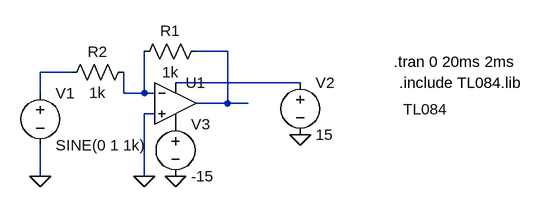
[diagram p0: schematic 03-Invert.asc]
03-Invert.asc, the LTspice schematic file:
Version 4
SHEET 1 880 680
WIRE 256 96 208 96
WIRE 16 128 -32 128
WIRE 368 144 176 144
WIRE -32 160 -32 128
WIRE 96 160 96 128
WIRE 128 160 128 96
WIRE 128 160 96 160
WIRE 144 160 128 160
WIRE 256 176 256 96
WIRE 256 176 208 176
WIRE 288 176 256 176
WIRE 144 192 128 192
WIRE -32 288 -32 240
WIRE 128 288 128 192
FLAG -32 288 0
FLAG 128 288 0
FLAG 368 224 0
FLAG 176 288 0
SYMBOL res 224 80 R90
WINDOW 0 0 56 VBottom 2
WINDOW 3 32 56 VTop 2
SYMATTR InstName R1
SYMATTR Value 1k
SYMBOL res 112 112 R90
WINDOW 0 0 56 VBottom 2
WINDOW 3 32 56 VTop 2
SYMATTR InstName R2
SYMATTR Value 1k
SYMBOL voltage -32 144 R0
WINDOW 123 0 0 Left 0
WINDOW 39 0 0 Left 0
SYMATTR InstName V1
SYMATTR Value SINE(0 1 1k)
SYMBOL voltage 368 128 R0
WINDOW 123 0 0 Left 0
WINDOW 39 0 0 Left 0
SYMATTR InstName V2
SYMATTR Value 15
SYMBOL voltage 176 192 R0
WINDOW 123 0 0 Left 0
WINDOW 39 0 0 Left 0
SYMATTR InstName V3
SYMATTR Value -15
SYMBOL Opamps\\opamp2 176 112 R0
WINDOW 3 350 73 Left 2
SYMATTR InstName U1
SYMATTR Value TL084
TEXT 512 112 Left 2 !.tran 0 20ms 2ms
TEXT 520 144 Left 2 !.include TL084.lib

The netlist it stands for:
* 03-Invert.asc
R1 N001 N004 1k
R2 N004 N002 1k
V1 N002 0 SINE(0 1 1k)
V2 N003 0 15
V3 P001 0 -15
XU1 0 N004 N003 P001 N001 TL084  ; pins In+ In- V+ V- OUT
.tran 0 20ms 2ms
.include TL084.lib
.backanno
.end